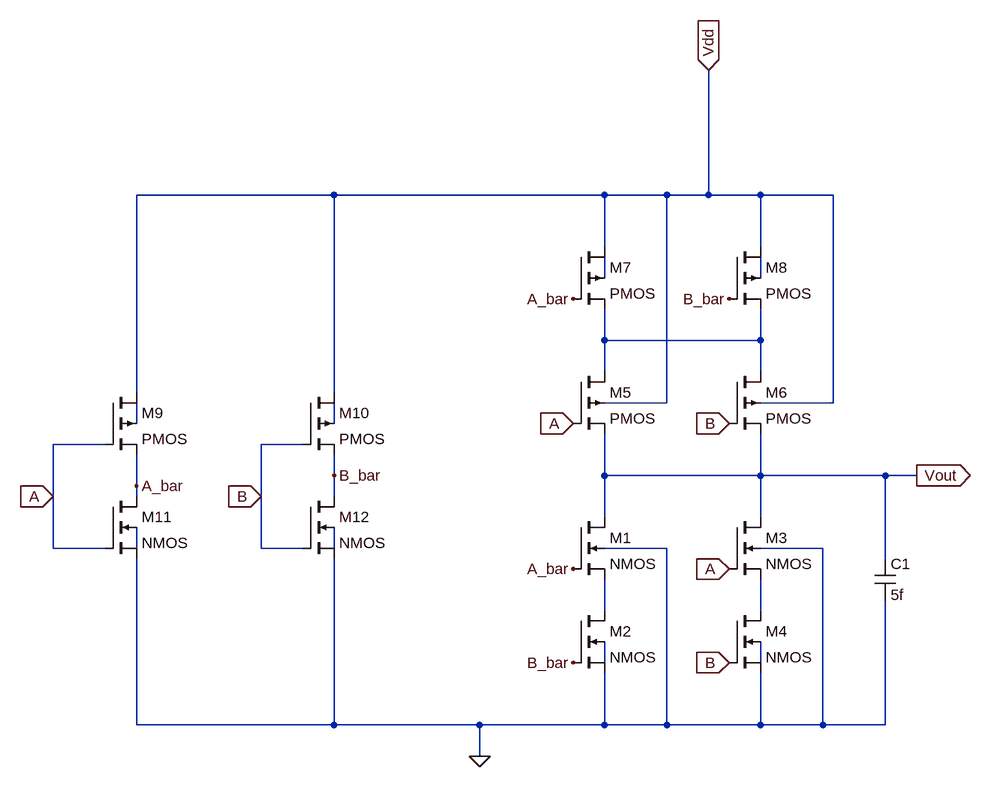
[diagram p0: schematic xor2.asc]
xor2.asc, the LTspice schematic file:
Version 4.1
SHEET 1 992 680
WIRE -16 -304 -320 -304
WIRE 400 -304 -16 -304
WIRE 496 -304 400 -304
WIRE 560 -304 560 -496
WIRE 560 -304 496 -304
WIRE 640 -304 560 -304
WIRE 752 -304 640 -304
WIRE 400 -224 400 -304
WIRE 640 -224 640 -304
WIRE 400 -176 400 -208
WIRE 640 -176 640 -208
WIRE 400 -80 400 -128
WIRE 640 -80 640 -128
WIRE 640 -80 400 -80
WIRE 400 -32 400 -80
WIRE 640 -32 640 -80
WIRE -320 0 -320 -304
WIRE -16 0 -16 -304
WIRE 496 16 496 -304
WIRE 496 16 400 16
WIRE 752 16 752 -304
WIRE 752 16 640 16
WIRE -320 48 -320 16
WIRE -16 48 -16 16
WIRE -368 80 -448 80
WIRE -64 80 -128 80
WIRE -16 128 -16 96
WIRE 400 128 400 64
WIRE 640 128 640 64
WIRE 640 128 400 128
WIRE 832 128 640 128
WIRE 880 128 832 128
WIRE -320 144 -320 96
WIRE -448 160 -448 80
WIRE -320 160 -320 144
WIRE -128 160 -128 80
WIRE -16 160 -16 128
WIRE 400 192 400 128
WIRE 640 192 640 128
WIRE -448 240 -448 160
WIRE -368 240 -448 240
WIRE -320 240 -320 208
WIRE -128 240 -128 160
WIRE -64 240 -128 240
WIRE -16 240 -16 208
WIRE 496 240 400 240
WIRE 736 240 640 240
WIRE 832 256 832 128
WIRE 400 336 400 288
WIRE 640 336 640 288
WIRE 400 416 400 384
WIRE 640 416 640 384
WIRE -320 512 -320 256
WIRE -16 512 -16 256
WIRE -16 512 -320 512
WIRE 208 512 -16 512
WIRE 400 512 400 432
WIRE 400 512 208 512
WIRE 496 512 496 240
WIRE 496 512 400 512
WIRE 640 512 640 432
WIRE 640 512 496 512
WIRE 736 512 736 240
WIRE 736 512 640 512
WIRE 832 512 832 320
WIRE 832 512 736 512
WIRE 208 560 208 512
FLAG 208 560 0
FLAG 352 48 A
IOPIN 352 48 In
FLAG 592 272 A
IOPIN 592 272 In
FLAG 592 48 B
IOPIN 592 48 In
FLAG 592 416 B
IOPIN 592 416 In
FLAG -448 160 A
IOPIN -448 160 In
FLAG -128 160 B
IOPIN -128 160 In
FLAG -320 144 A_bar
FLAG -16 128 B_bar
FLAG 352 -144 A_bar
FLAG 352 272 A_bar
FLAG 352 416 B_bar
FLAG 592 -144 B_bar
FLAG 880 128 Vout
IOPIN 880 128 Out
FLAG 560 -496 Vdd
IOPIN 560 -496 In
SYMBOL nmos4 352 192 R0
SYMATTR InstName M1
SYMATTR Value2 l=180n w=800n
SYMBOL nmos4 352 336 R0
SYMATTR InstName M2
SYMATTR Value2 l=180n w=800n
SYMBOL nmos4 592 192 R0
SYMATTR InstName M3
SYMATTR Value2 l=180n w=800n
SYMBOL nmos4 592 336 R0
SYMATTR InstName M4
SYMATTR Value2 l=180n w=400n
SYMBOL pmos4 352 -32 R0
SYMATTR InstName M5
SYMATTR Value2 l=180n w=1600n
SYMBOL pmos4 592 -32 R0
SYMATTR InstName M6
SYMATTR Value2 l=180n w=1600n
SYMBOL pmos4 352 -224 R0
SYMATTR InstName M7
SYMATTR Value2 l=180n w=1600n
SYMBOL pmos4 592 -224 R0
SYMATTR InstName M8
SYMATTR Value2 l=180n w=1600n
SYMBOL pmos4 -368 0 R0
SYMATTR InstName M9
SYMATTR Value2 l=180n w=800n
SYMBOL pmos4 -64 0 R0
SYMATTR InstName M10
SYMATTR Value2 l=180n w=800n
SYMBOL nmos4 -368 160 R0
SYMATTR InstName M11
SYMATTR Value2 l=180n w=400n
SYMBOL nmos4 -64 160 R0
SYMATTR InstName M12
SYMATTR Value2 l=180n w=400n
SYMBOL cap 816 256 R0
SYMATTR InstName C1
SYMATTR Value 5f

The netlist it stands for:
* xor2.asc
M1 Vout A_bar N008 0 NMOS l=180n w=800n
M2 N008 B_bar 0 N010 NMOS l=180n w=800n
M3 Vout A N009 0 NMOS l=180n w=800n
M4 N009 B 0 N011 NMOS l=180n w=400n
M5 N003 A Vout Vdd PMOS l=180n w=1600n
M6 N003 B Vout Vdd PMOS l=180n w=1600n
M7 Vdd A_bar N003 N001 PMOS l=180n w=1600n
M8 Vdd B_bar N003 N002 PMOS l=180n w=1600n
M9 Vdd A A_bar N004 PMOS l=180n w=800n
M10 Vdd B B_bar N005 PMOS l=180n w=800n
M11 A_bar A 0 N006 NMOS l=180n w=400n
M12 B_bar B 0 N007 NMOS l=180n w=400n
C1 Vout 0 5f
.model NMOS NMOS
.model PMOS PMOS
.lib standard.mos
.backanno
.end